# Altium schematic sheet UCC28180_PFC_Controller.SchDoc
size A4; SheetNumber: 6; SheetTotal: 8
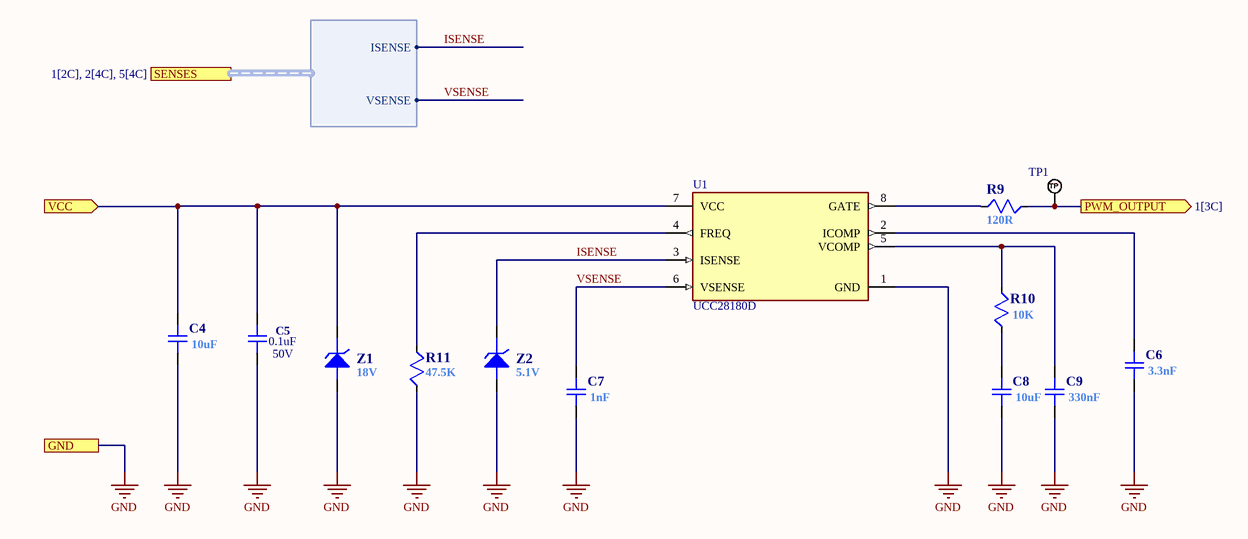
[diagram p0: UCC28180_PFC_Controller.SchDoc]

## Parts
C4  value 10uF  [CAP_0805]  (hidden comment: CL21A106KAYNNNE)
C5  value 0.1uF  Rating: 50V  [CAPC1608N]  (hidden comment: CL10B104KB8NNNC)
C6  value 3.3nF  [CAP_0805]  (hidden comment: CL10B332KB8NNNC)
C7  value 1nF  [CAP_0805]  (hidden comment: CL10B102KB8NNNC)
C8  value 10uF  [CAP_0805]  (hidden comment: CL21A106KAYNNNE)
C9  value 330nF  [CAP_0805]  (hidden comment: CL10F334ZA8NNNC)
R9  value 120R  [RESC1608N]  (hidden comment: CRT03J7E1200)
R10  value 10K  [RESC1608N]  (hidden comment: RC0603JR-0710KL)
R11  value 47.5K  [RESC1608N]  (hidden comment: 0603SAF4752T5E)
TP1  TP_NOBOM  [PAD_RND_1MM]  (value not drawn)  (no BOM)
U1  UCC28180D  [FP-D0008A-MFG]
Z1  value 18V  [SOD523C]  (hidden comment: MMSZ18V-HT)
Z2  value 5.1V  [SOD523C]  (hidden comment: BZT52C5V1TQ-7-F)

## Ports
GND (see 1[2C], 2[1D], 3[1D], 4[4C], 5[1D], 7[1C], 8[1C]), PWM_OUTPUT (out, see 1[3C]), SENSES (harness SENSES, see 1[2C], 2[4C], 5[4C]), VCC (in, see 1[2C], 2[1A], 3[4A], 7[1B])

## Harnesses
SENSES: ISENSE, VSENSE

## Nets
GND: C4.1 C5.1 C6.1 C7.1 C8.1 C9.1 R11.1 U1.1(GND) Z1.1(A) Z2.1(A) ; port GND
ISENSE: U1.3(ISENSE) Z2.2(K) ; port SENSES.ISENSE
PWM_OUTPUT: R9.2 TP1.1(TP) ; port PWM_OUTPUT
VCC: C4.2 C5.2 U1.7(VCC) Z1.2(K) ; port VCC
VSENSE: C7.2 U1.6(VSENSE) ; port SENSES.VSENSE
NetC6_2: C6.2 U1.2(ICOMP)
NetC8_2: C8.2 R10.2
NetC9_2: C9.2 R10.1 U1.5(VCOMP)
NetR9_1: R9.1 U1.8(GATE)
NetR11_2: R11.2 U1.4(FREQ)

## Library data of the parts
C4 C8 = CAP_0805: MLCC (2012) 0805 10uF 25VDC ±10% X5R; Manufacturer: YAGEO; Manufacturer Part Number: CC0805KKX7R9BB105; Rating: 50V; Distributor Link: https://www.digikey.com/en/products/detail/yageo/CC0805KKX7R9BB105/5195292; LCSC: X7R; Dielectric: *
C5 = CAP_0805: MLCC (1608) 0603 100nF 50VDC ±10% X7R; Manufacturer: *; Manufacturer Part Number: *; Distributor Link: *; LCSC: *
C6 = CAP_0805: MLCC (1608) 0603 3.3nF 50VDC ±10% X7R; Manufacturer: YAGEO; Manufacturer Part Number: CC0805KKX7R9BB105; Rating: 50V; Distributor Link: https://www.digikey.com/en/products/detail/yageo/CC0805KKX7R9BB105/5195292; LCSC: X7R; Dielectric: *
C7 = CAP_0805: MLCC (1608) 0603 1nF 50VDC ±10% X7R; Manufacturer: YAGEO; Manufacturer Part Number: CC0805KKX7R9BB105; Rating: 50V; Distributor Link: https://www.digikey.com/en/products/detail/yageo/CC0805KKX7R9BB105/5195292; LCSC: X7R; Dielectric: *
C9 = CAP_0805: MLCC (1608) 0603 330nF 25VDC -20% +80% Y5V; Manufacturer: YAGEO; Manufacturer Part Number: CC0805KKX7R9BB105; Rating: 50V; Distributor Link: https://www.digikey.com/en/products/detail/yageo/CC0805KKX7R9BB105/5195292; LCSC: X7R; Dielectric: *
R9 = RES: RES.(1608) 0603 120 Ohms 5% 1/10W-S 100PPM
R10 = RES: RES.(1608) 0603 10K Ohms 5% 1/10W 100PPM SMT
R11 = RES: RES.(1608) 0603 47.5K Ohms 1% 1/10W-S 100PPM
TP1 = TEST_POINT_RND_1MM: Test Point Round 1mm (NO BOM)
U1 = CMP-04918-000038-1: IC PFC CTRLR AVERAGE CURR 8SOIC; Manufacturer: Texas Instruments; Max Supply Voltage: 21V; Output Type: Fixed; Max Duty Cycle: 98%; Number Of Outputs: 1; Output Voltage: 390mV; Standoff Height: 0.11mm; Output Current: 40uA; Nominal Supply Current: 7mA; Switching Frequency: 65kHz; Max Junction Temp: +125°C; Switching Topology: Buck; Lead Free: Yes; Height: 1.75mm; Automotive: No; Category: IC; Device Class L1: Integrated Circuits (ICs); Octopart: https://octopart.com/ucc28180d-texas+instruments-31566950; Mouser Description: Power Factor Correction - PFC 8-PIN CCM PFC CONTROLLER; Ipc Land Pattern Name: SOIC127P600X175-8; RoHS: TRUE; Temperature: -40°C to +125°C; Package: D0008A; Temperature Range High: +125°C; Device Class L3: Voltage Regulators - Switching; ComponentLink2Description: Datasheet; Device Class L2: Power Management ICs; Manufacturer Part Number: UCC28180D; Temperature Range Low: -40°C; Digikey Description: IC PFC CTRLR AVERAGE CURR 8SOIC; ComponentLink2URL: http://www.ti.com/lit/ds/symlink/ucc28180.pdf
Z1 = ZENER-1: DIODE ZENER 500mW 18V ±5% SOD123 SMT
Z2 = ZENER-1: Zener Diode 5.1 V 300 mW ±6% Surface Mount SOD-523